# EAGLE design traffic light (EAGLE 9.6.2)
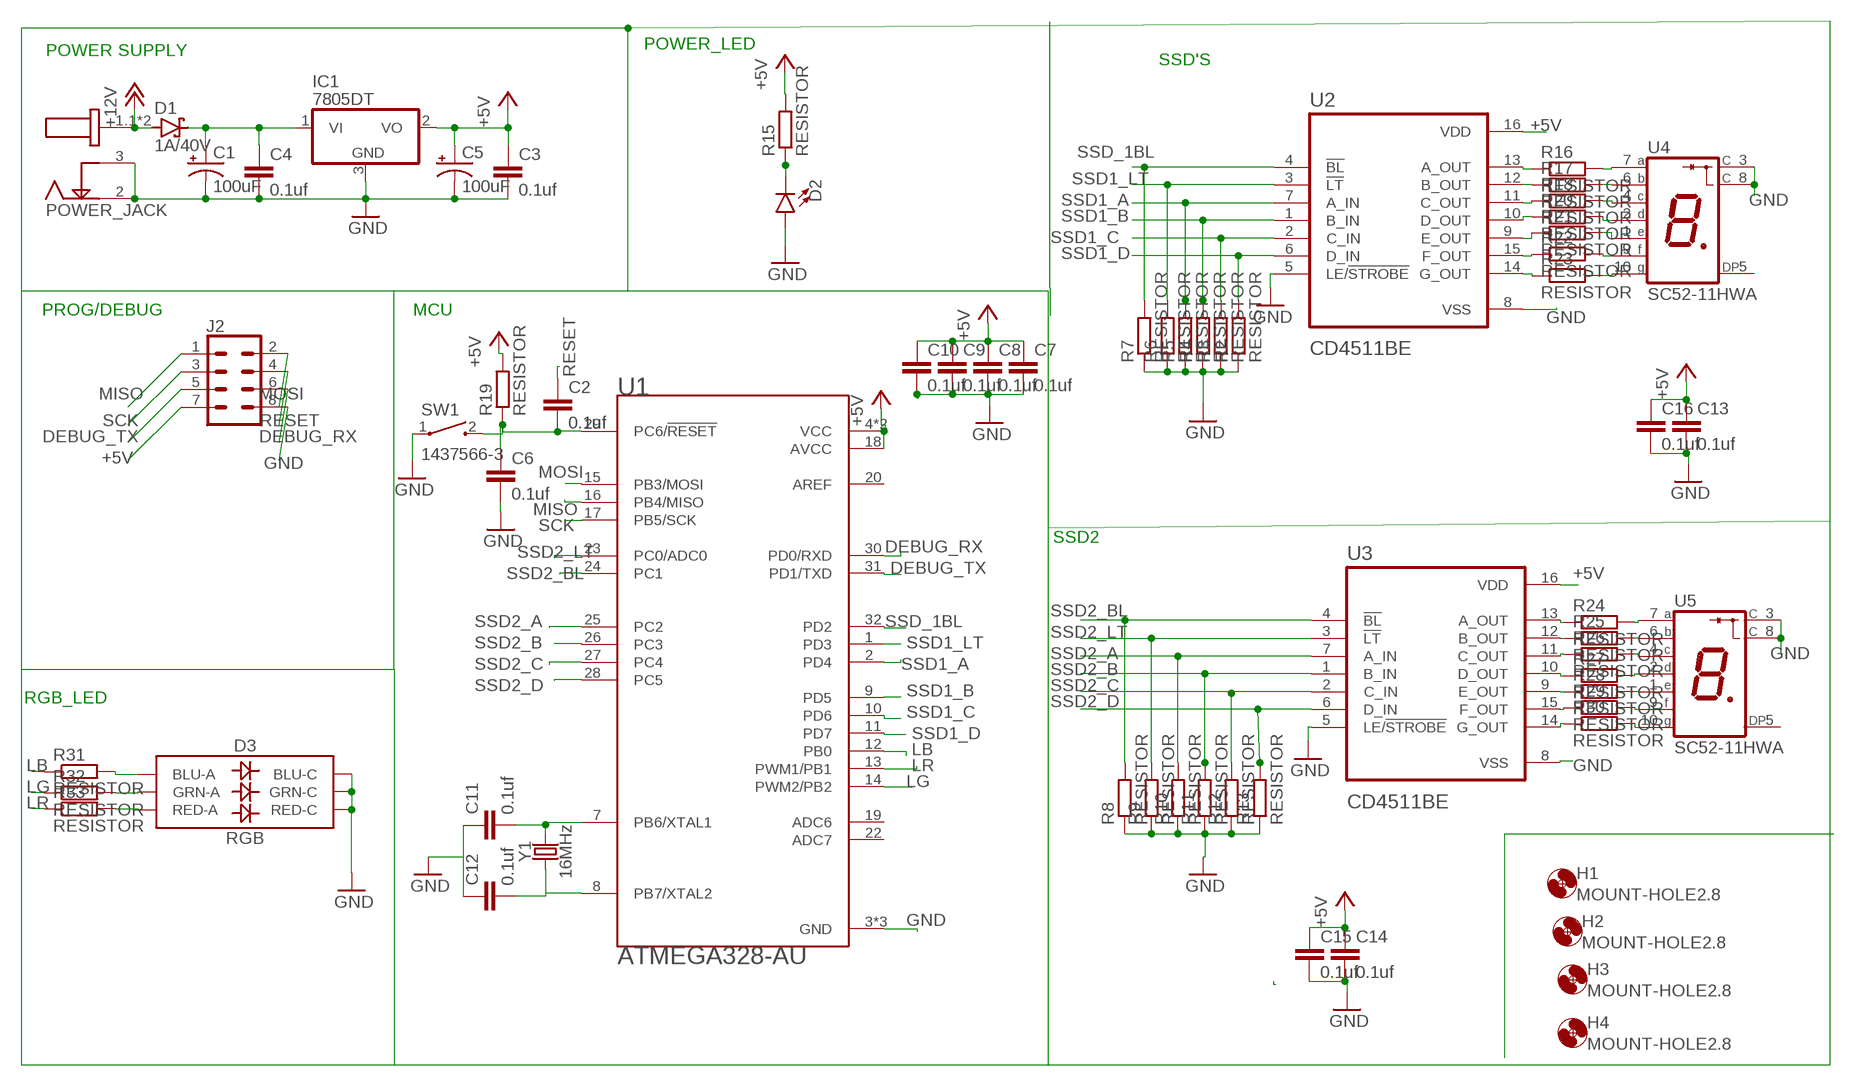
[diagram p0: schematic, sheet 1]

## Parts
C1  100uF  100UF-POLAR-25V-20%-SMD(ELEC)  [PANASONIC_D]
C2  0.1uf  C2.5/2  [C2.5-2]
C3  0.1uf  C2,5-3  [C2.5-3]
C4  0.1uf  C2.5/2  [C2.5-2]
C5  100uF  100UF-POLAR-25V-20%-SMD(ELEC)  [PANASONIC_D]
C6  0.1uf  C2.5/2  [C2.5-2]
C7  0.1uf  C2,5-3  [C2.5-3]
C8  0.1uf  C2,5-3  [C2.5-3]
C9  0.1uf  C2,5-3  [C2.5-3]
C10  0.1uf  C2,5-3  [C2.5-3]
C11  0.1uf  C2.5/2  [C2.5-2]
C12  0.1uf  C2.5/2  [C2.5-2]
C13  0.1uf  C2,5-3  [C2.5-3]
C14  0.1uf  C2,5-3  [C2.5-3]
C15  0.1uf  C2,5-3  [C2.5-3]
C16  0.1uf  C2,5-3  [C2.5-3]
D1  1A/40V  SCHOTTKY-DIODEC4111-15  [C4111-15]
D2  LED0603  [LED-0603]
D3  RGB  LED-RGBPLCC-6  [PLCC-6-LED]
H1  MOUNT-HOLE2.8  [2,8]
H2  MOUNT-HOLE2.8  [2,8]
H3  MOUNT-HOLE2.8  [2,8]
H4  MOUNT-HOLE2.8  [2,8]
IC1  7805DT  [TO252]
J2  CONN_04X2  [2X4]
POWER_JACK  DCJ200-05-A-XX-X_REVA  [GCT_DCJ200-05-A-XX-X_REVA]
R2  RESISTOR  [R0603]
R3  RESISTOR  [R0603]
R4  RESISTOR  [R0603]
R5  RESISTOR  [R0603]
R6  RESISTOR  [R0603]
R7  RESISTOR  [R0603]
R8  RESISTOR  [R0603]
R9  RESISTOR  [R0603]
R10  RESISTOR  [R0603]
R11  RESISTOR  [R0603]
R12  RESISTOR  [R0603]
R13  RESISTOR  [R0603]
R15  RESISTOR  [R0603]
R16  RESISTOR  [R0603]
R17  RESISTOR  [R0603]
R18  RESISTOR  [R0603]
R19  RESISTOR  [R0603]
R20  RESISTOR  [R0603]
R21  RESISTOR  [R0603]
R22  RESISTOR  [R0603]
R23  RESISTOR  [R0603]
R24  RESISTOR  [R0603]
R25  RESISTOR  [R0603]
R26  RESISTOR  [R0603]
R27  RESISTOR  [R0603]
R28  RESISTOR  [R0603]
R29  RESISTOR  [R0603]
R30  RESISTOR  [R0603]
R31  RESISTOR  [R0603]
R32  RESISTOR  [R0603]
R33  RESISTOR  [R0603]
SW1  1437566-3  [SW_1437566-3]
U1  ATMEGA328-AU  [QFP80P900X900X120-32N]
U2  CD4511BE  [DIP794W45P254L1969H508Q16]
U3  CD4511BE  [DIP794W45P254L1969H508Q16]
U4  SC52-11HWA  [LED_SC52-11HWA]
U5  SC52-11HWA  [LED_SC52-11HWA]
Y1  16MHz  CRYSTAL-16MHZPTH-HC49US  [HC49US]

## Nets
+5V: C3.1 C5.+ C7.1 C8.1 C9.1 C10.1 C13.1 C14.1 C15.1 C16.1 IC1.2(VO) J2.7 R15.2 R19.2 U1.4(VCC) U1.6(VCC) U1.18(AVCC) U2.16(VDD) U3.16(VDD)
+12V: D1.A POWER_JACK.1.1 POWER_JACK.1.2
DEBUG_RX: J2.6 U1.30(PD0/RXD)
DEBUG_TX: J2.5 U1.31(PD1/TXD)
GND: C1.- C3.2 C4.2 C5.- C6.2 C7.2 C8.2 C9.2 C10.2 C13.2 C14.2 C15.2 C16.2 D2.A D3.CB(BLU-C) D3.CG(GRN-C) D3.CR(RED-C) IC1.3(GND) J2.8 POWER_JACK.2 POWER_JACK.3 R2.1 R3.1 R4.1 R5.1 R6.1 R7.1 R8.1 R9.1 R10.1 R11.1 R12.1 R13.1 SW1.1 U1.3(GND) U1.5(GND) U1.21(GND) U2.5(LE/!STROBE) U2.8(VSS) U3.5(LE/!STROBE) U3.8(VSS) U4.3(C) U4.8(C) U5.3(C) U5.8(C)
LB: R31.1 U1.12(PB0)
LG: R32.1 U1.14(PWM2/PB2)
LR: R33.1 U1.13(PWM1/PB1)
MISO: J2.1 U1.16(PB4/MISO)
MOSI: J2.2 U1.15(PB3/MOSI)
N$4: C1.+ C4.1 D1.C IC1.1(VI)
N$5: D3.AB(BLU-A) R31.2
N$6: D3.AG(GRN-A) R32.2
N$8: D2.C R15.1
N$9: R16.1 U2.13(A_OUT)
N$10: R16.2 U4.7(A)
N$11: R17.2 U4.6(B)
N$12: R17.1 U2.12(B_OUT)
N$13: R18.1 U2.11(C_OUT)
N$14: R20.1 U2.10(D_OUT)
N$15: R21.1 U2.9(E_OUT)
N$16: R22.1 U2.15(F_OUT)
N$17: R24.1 U3.13(A_OUT)
N$18: R24.2 U5.7(A)
N$19: R25.1 U3.12(B_OUT)
N$20: R26.1 U3.11(C_OUT)
N$21: R27.1 U3.10(D_OUT)
N$22: R28.1 U3.9(E_OUT)
N$23: R29.1 U3.15(F_OUT)
N$47: C2.2 C6.1 R19.1 SW1.2 U1.29(PC6/!RESET)
N$48: C11.2 U1.7(PB6/XTAL1) Y1.2
N$49: C12.2 U1.8(PB7/XTAL2) Y1.1
N$50: C11.1 C12.1
N$51: R23.1 U2.14(G_OUT)
N$52: R18.2 U4.4(C)
N$53: R20.2 U4.2(D)
N$54: R21.2 U4.1(E)
N$55: R22.2 U4.9(F)
N$56: R23.2 U4.10(G)
N$57: R30.1 U3.14(G_OUT)
N$58: R30.2 U5.10(G)
N$59: R29.2 U5.9(F)
N$60: R25.2 U5.6(B)
N$61: R26.2 U5.4(C)
N$62: R27.2 U5.2(D)
N$63: R28.2 U5.1(E)
N$65: D3.AR(RED-A) R33.2
RESET: C2.1 J2.4
SCK: J2.3 U1.17(PB5/SCK)
SSD1_A: R5.2 U1.2(PD4) U2.7(A_IN)
SSD1_B: R4.2 U1.9(PD5) U2.1(B_IN)
SSD1_C: R3.2 U1.10(PD6) U2.2(C_IN)
SSD1_D: R2.2 U1.11(PD7) U2.6(D_IN)
SSD1_LT: R6.2 U1.1(PD3) U2.3(!LT)
SSD2_A: R10.2 U1.25(PC2) U3.7(A_IN)
SSD2_B: R11.2 U1.26(PC3) U3.1(B_IN)
SSD2_BL: R8.2 U1.24(PC1) U3.4(!BL)
SSD2_C: R12.2 U1.27(PC4) U3.2(C_IN)
SSD2_D: R13.2 U1.28(PC5) U3.6(D_IN)
SSD2_LT: R9.2 U1.23(PC0/ADC0) U3.3(!LT)
SSD_1BL: R7.2 U1.32(PD2) U2.4(!BL)
Unconnected: U1.19(ADC6) U1.20(AREF) U1.22(ADC7) U4.5(DP) U5.5(DP)

## Notes on the sheet
- POWER_LED
- POWER SUPPLY
- SSD'S
- PROG/DEBUG | MCU
- SSD2
- RGB_LED

## Library data of the parts
C1 C5 = SparkFun-Capacitors:100UF-POLAR: 100µF polarized capacitors A capacitor is a passive two-terminal electrical component used to store electrical energy temporarily in an electric field.; PN: EDH107M025A9HAA; PROD_ID: CAP-17222
C2-C4 C6-C16 = capacitor-wima:C: CAPACITOR naming: grid - package width
D1 = diode:SCHOTTKY-DIODE: Schottky Diode
D2 = SparkFun-LED:LED: LED (Generic) Standard schematic elements and footprints for 5mm, 3mm, 1206, and 0603 sized LEDs. Generic LEDs with no color specified.
D3 = SparkFun-LED:LED-RGB: LED-RGB 6 pin RGB LED (no common connector) Packages: PLCC-6 LED-TRICOLOR-5050 - No built-in IC SparkFun Products: Digital Sandbox <https://www.sparkfun.com/products/12651> LED- SMD RGB <https://www.sparkfun.com/products/10866>; PROD_ID: DIO-12113
H1-H4 = holes:MOUNT-HOLE: MOUNTING HOLE with drill center marker
IC1 = PC_IC_L7805_TO252:78*: Positive VOLTAGE REGULATOR Source: http://cache.national.com/ds/LM/LM78L05.pdf http://www.fairchildsemi.com/ds/LM/LM7805.pdf
J2 = SparkFun-Connectors:CONN_04X2: Multi connection point. Often used as Generic Header-pin footprint for 0.1 inch spaced/style header connections On any of the 0.1 inch spaced packages, you can populate with these: Break Away Headers - Straight <https://www.sparkfun.com/products/116> (PRT-00116) Break Away Male Headers - Right Angle <https://www.sparkfun.com/products/553> (PRT-00553) Female Headers <https://www.sparkfun.com/products/115> (PRT-00115) Break Away Headers - Machine Pin <https://www.sparkfun.com/products/117> (PRT-00117) Break Away Female Headers - Swiss Machine Pin <https://www.sparkfun.com/products/743> (PRT-00743)
POWER_JACK = PC_CON_DC_Power_Jack:DCJ200-05-A-XX-X_REVA: DC Power Jack, SMT, Horizontal, with Locating Pegs, D2.0mm Check prices <https://pricing.snapeda.com/parts/DCJ200-05-A-K1-A/Global%20Connector%20Technology/view-part?ref=eda>; AVAILABILITY: Warning; DESCRIPTION: Power Barrel Connector Jack 2.05mm ID (0.081), 5.50mm OD (0.217) Surface Mount, Right Angle; MF: Global Connector Technology; MP: DCJ200-05-A-K1-A; PACKAGE: None; PRICE: None; PURCHASE-URL: https://pricing.snapeda.com/search/part/DCJ200-05-A-K1-A/?ref=eda
R2-R13 R15-R33 = PC_Resistor_0603:RESISTOR; MF: Yageo; RESISTOR: 0603
SW1 = PC_Switch_1437566-3:1437566-3: Switch Tactile OFF (ON) SPST Rectangular Button Gull Wing 0.05A 12VDC SMD Loose Piece Check prices <https://pricing.snapeda.com/parts/1437566-3/TE%20Connectivity/view-part?ref=eda>; AVAILABILITY: Good; COMMENT: 1437566-3; CONFIGURATION_POLE-THROW: Single Pole - Single Throw; CONTACT_CURRENT_RATING: 50 mA; DESCRIPTION: Tactile Switch SPST-NO Top Actuated Surface Mount; MF: TE Connectivity; MP: 1437566-3; PACKAGE: None; PRICE: None
U1 = PC_IC_ATMEGA328P-AU:ATMEGA328-AU: ATmega Series 20 MHz 32 KB Flash 2 KB SRAM 8-Bit Microcontroller - TQFP-32 Check prices <https://pricing.snapeda.com/parts/ATMEGA328-AU/Microchip/view-part?ref=eda>; AVAILABILITY: In Stock; DESCRIPTION: AVR AVR® ATmega Microcontroller IC 8-Bit 20MHz 32KB (16K x 16) FLASH 32-TQFP (7x7); MF: Microchip; MP: ATMEGA328-AU; PACKAGE: TQFP-32 Microchip; PRICE: None; PURCHASE-URL: https://pricing.snapeda.com/search/part/ATMEGA328-AU/?ref=eda
U2 U3 = PC_IC_CD4511BE:CD4511BE: None Check availability <https://pricing.snapeda.com/parts/CD4511BE/Texas%20Instruments/view-part?ref=eda>; AVAILABILITY: In Stock; DESCRIPTION: CMOS BCD-to-7-Segment LED Latch Decoder Drivers 16-PDIP -55 to 125; MF: Texas Instruments; MP: CD4511BE; PACKAGE: PDIP-16 Texas Instruments; PRICE: None; PURCHASE-URL: https://pricing.snapeda.com/search/part/CD4511BE/?ref=eda
U4 U5 = PC_LED-7-SegmentDisplay:SC52-11HWA: Display: LED; single 7-segment; 13.2mm; red; 0.9-2.2mcd Check availability <https://pricing.snapeda.com/parts/SC52-11HWA/Kingbright/view-part?ref=eda>; AVAILABILITY: Not in stock; DESCRIPTION: Display: LED; single 7-segment; 13.2mm; red; 0.9-2.2mcd; MF: Kingbright; MP: SC52-11HWA; PACKAGE: None; PRICE: None
Y1 = SparkFun-Clocks:CRYSTAL-16MHZ: 16MHz Crystal Digikey Example <http://www.digikey.com/product-search/en?keywords=535-9122-1-ND> Frequency: 16MHz Frequency Stability: ±50ppm Frequency Tolerance: ±20ppm Load Capacitance: 18pF SparkFun Products: Pro Micro -5V/16MHz <https://www.sparkfun.com/products/12640> SparkFun Serial Enabled LCD Kit <https://www.sparkfun.com/products/10097>; PROD_ID: XTAL-08181; SF_ID: COM-00536

## Board
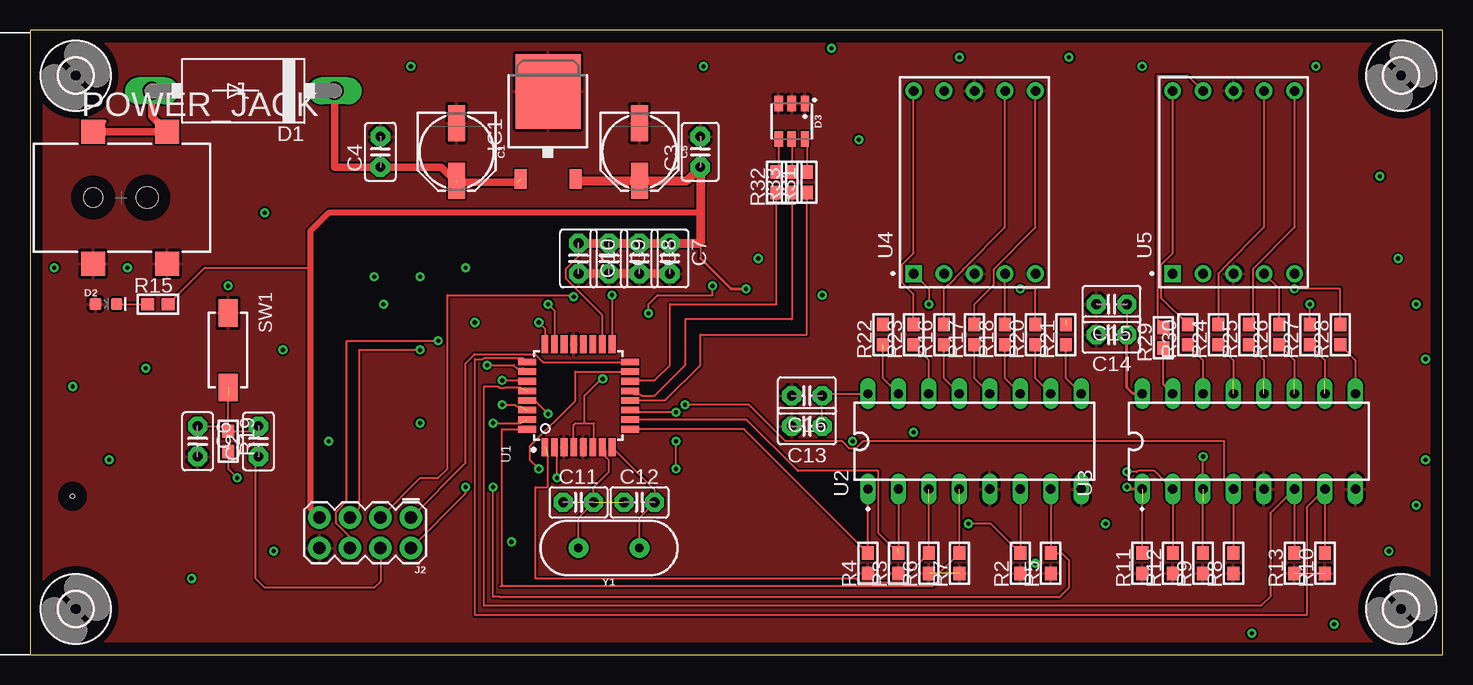
[diagram p1: board, top side]
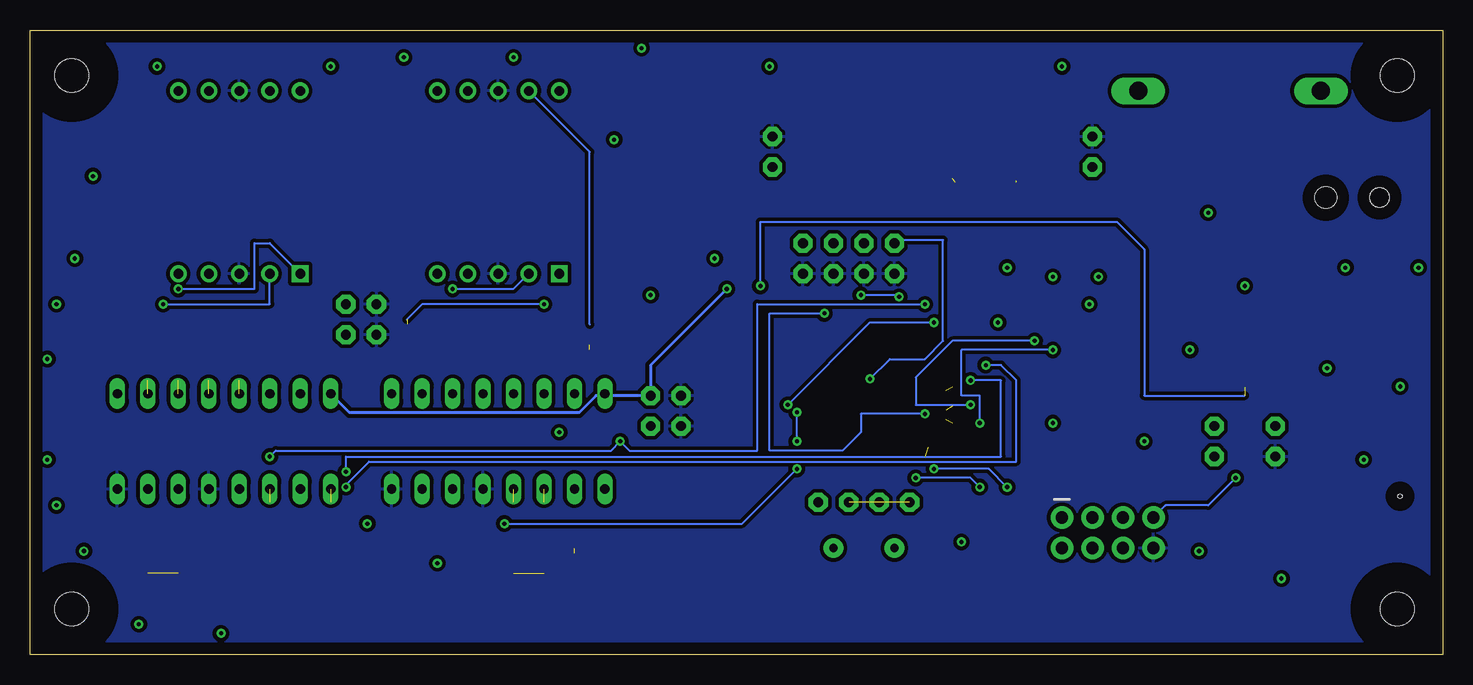
[diagram p2: board, bottom side, seen from below]

Size 117.78 x 52.06 mm. Coordinates in mm from the lower left corner, seen from the top.
Outline: 0,0 117.78,0 117.78,52.06 0,52.06 0,0
Copper layers (1*16): Top 0.035mm / dielectric 1.5mm / Bottom 0.035mm
Design rules "default": minimum track width 6mil, minimum drill 0.35mm, track to track 6mil, track to pad 6mil, pad to pad 6mil, via to via 6mil, smd to smd 6mil, copper to edge 40mil, drill to drill 6mil, minimum pad ring 10mil, minimum via ring 8mil, stop-mask expansion 4mil, vias tented up to drill 0mil, thermal gap 10mil
Holes 0.35 mm at 3.56,13.21 3.56,13.21

### Footprints (pad centres in the part's own frame; a part is rotated, then mirrored left to right if it is on the bottom)
PANASONIC_D = smd 3 x 1.4: + 2.4,0; - -2.4,0
C2.5-2 = drill 0.813 pad 1.6 octagon: 1 -1.27,0; 2 1.27,0
C2.5-3 = drill 0.813 pad 1.6 octagon: 1 -1.27,0; 2 1.27,0
C4111-15 = drill 1.499 long: A 7.62,0; C -7.62,0
LED-0603 = smd 1 x 1: A -0.877,0; C 0.877,0
PLCC-6-LED = smd 1.3 x 0.7: AB 1.475,1.1; AG 1.475,-1.1; AR 1.475,0; CB -1.475,1.1; CG -1.475,-1.1; CR -1.475,0
2,8 = hole 2.8: 0,0
TO252 = smd 1 x 1.6: 1 -2.28,-4.8; 2 2.28,-4.8 | smd 5.4 x 6.2: 3 0,2.5
2X4 = drill 1.016 pad 1.88: 1 -3.81,-1.27; 2 -3.81,1.27; 3 -1.27,-1.27; 4 -1.27,1.27; 5 1.27,-1.27; 6 1.27,1.27; 7 3.81,-1.27; 8 3.81,1.27
GCT_DCJ200-05-A-XX-X_REVA = smd 2 x 2: 1.1 -5.5,3.8; 1.2 -5.5,-2.35; 2 5.5,-2.35; 3 5.5,3.8 | hole 1.8: 0,2.15 | hole 1.6: 0,-2.35
R0603 = smd 1.1 x 1: 1 -0.85,0; 2 0.85,0
SW_1437566-3 = smd 2.3 x 1.6: 1 -3.08,0; 2 3.12,0
QFP80P900X900X120-32N = smd 1.5 x 0.55: 1 -4.3,2.8; 2 -4.3,2; 3 -4.3,1.2; 4 -4.3,0.4; 5 -4.3,-0.4; 6 -4.3,-1.2; 7 -4.3,-2; 8 -4.3,-2.8; 17 4.3,-2.8; 18 4.3,-2; 19 4.3,-1.2; 20 4.3,-0.4; 21 4.3,0.4; 22 4.3,1.2; 23 4.3,2; 24 4.3,2.8 | smd 0.55 x 1.5: 9 -2.8,-4.3; 10 -2,-4.3; 11 -1.2,-4.3; 12 -0.4,-4.3; 13 0.4,-4.3; 14 1.2,-4.3; 15 2,-4.3; 16 2.8,-4.3; 25 2.8,4.3; 26 2,4.3; 27 1.2,4.3; 28 0.4,4.3; 29 -0.4,4.3; 30 -1.2,4.3; 31 -2,4.3; 32 -2.8,4.3
DIP794W45P254L1969H508Q16 = drill 0.78 pad 1.13 long: 1 -3.97,8.89; 2 -3.97,6.35; 3 -3.97,3.81; 4 -3.97,1.27; 5 -3.97,-1.27; 6 -3.97,-3.81; 7 -3.97,-6.35; 8 -3.97,-8.89; 9 3.97,-8.89; 10 3.97,-6.35; 11 3.97,-3.81; 12 3.97,-1.27; 13 3.97,1.27; 14 3.97,3.81; 15 3.97,6.35; 16 3.97,8.89
LED_SC52-11HWA = drill 0.8 pad 1.4 square: 1 -7.62,5.08 | drill 0.8 pad 1.4: 2 -7.62,2.54; 3 -7.62,0; 4 -7.62,-2.54; 5 -7.62,-5.08; 6 7.62,-5.08; 7 7.62,-2.54; 8 7.62,0; 9 7.62,2.54; 10 7.62,5.08
HC49US = drill 0.7 pad 1.651: 1 -2.54,0; 2 2.54,0

### Placement (x,y rotation side)
C1  35.56,41.91 270 top
C2  19.05,17.78 90 top
C3  55.88,41.91 90 top
C4  29.21,41.91 90 top
C5  50.8,41.91 270 top
C6  13.97,17.78 270 top
C7  53.34,33.02 270 top
C8  50.8,33.02 270 top
C9  48.26,33.02 270 top
C10  45.72,33.02 270 top
C11  45.72,12.7 0 top
C12  50.8,12.7 0 top
C13  64.77,19.05 180 top
C14  90.17,26.67 180 top
C15  90.17,29.21 180 top
C16  64.77,21.59 180 top
D1  17.78,46.99 180 top
D2  6.35,29.21 0 top
D3  63.5,44.45 270 top
H1  114.3,3.81 0 top
H2  3.81,3.81 0 top
H3  114.3,48.26 0 top
H4  3.81,48.26 0 top
IC1  43.18,44.45 0 top
J2  27.94,10.16 180 top
POWER_JACK  7.62,38.1 270 top
R2  82.55,7.62 90 top
R3  72.39,7.62 90 top
R4  69.85,7.62 90 top
R5  85.09,7.62 90 top
R6  74.93,7.62 90 top
R7  77.47,7.62 90 top
R8  100.33,7.62 90 top
R9  97.79,7.62 90 top
R10  107.95,7.62 90 top
R11  92.71,7.62 90 top
R12  95.25,7.62 90 top
R13  105.41,7.62 90 top
R15  10.67,29.21 0 top
R16  76.2,26.67 90 top
R17  78.74,26.67 90 top
R18  81.28,26.67 90 top
R19  16.51,17.78 270 top
R20  83.82,26.67 90 top
R21  86.36,26.67 90 top
R22  71.12,26.67 90 top
R23  73.66,26.67 90 top
R24  99.06,26.67 90 top
R25  101.6,26.67 90 top
R26  104.14,26.67 90 top
R27  106.68,26.67 90 top
R28  109.22,26.67 90 top
R29  94.49,26.42 90 top
R30  96.52,26.67 90 top
R31  64.77,39.37 90 top
R32  62.23,39.37 90 top
R33  63.5,39.37 90 top
SW1  16.51,25.4 270 top
U1  45.72,21.59 90 top
U2  78.74,17.78 90 top
U3  101.6,17.78 90 top
U4  78.74,39.37 90 top
U5  100.33,39.37 90 top
Y1  48.26,8.89 180 top

### Tracks (layer width: path | path; a pad name or v marks a point on that pad's centre or on a via)
+5V  (via drill 0.35)
  Top 0.152: U1.18 47.72,28.29 44.69,31.32 44.69,32.18 45.72,33.2 C10.1 | C13.1 C16.1 66.2,21.75 U2.16 | C15.1 C14.1 | 55.88,34.29 55.88,33.02 | R19.2 16.51,15.49 v17.27,14.73 | R15.2 14.57,32.26 23.37,32.26 | U1.4 45.32,19.16 45.47,19.3 46.23,19.3 | 46.23,19.3 46.99,19.3 46.99,17.36 U1.6 | 46.23,19.3 46.23,21.59 47.75,23.11 v47.75,22.98
  Top 0.254: 55.88,33.02 58.42,30.48 v59.69,30.48 | U3.16 91.95,21.75 91.44,22.26 C14.1
  Top 0.508: 55.88,36.83 24.89,36.83 23.37,35.31 23.37,32.26 23.37,12.19 J2.7
  Top 0.737: IC1.2 45.6,39.51 C5.+ 54.75,39.51 C3.1 55.88,36.83 55.88,34.29 C7.1 C8.1 C9.1 C10.1
  Bottom 0.152: v17.27,14.73 19.56,12.45 23.11,12.45 J2.7 | v47.75,22.98 46.1,24.64 43.18,24.64 41.66,26.16 41.66,34.54 45.47,34.54 C10.1
  Bottom 0.254: v59.69,30.48 66.04,24.13 C16.1 70.6,21.59 72.01,20.18 91.14,20.18 U3.16
+12V
  Top 0.152: POWER_JACK.1.2 5.5,43.6 6.35,44.45
  Top 0.635: POWER_JACK.1.2 POWER_JACK.1.1 10.16,44.86 D1.A
DEBUG_RX  (via drill 0.35)  (1 unrouted)
  Top 0.152: J2.6 26.67,9.78 25.5,10.95 25.5,11.91 26.42,12.83 26.42,26.16 v34.04,26.16 | 40.89,20.69 40.57,20.69 40.43,20.83 v39.37,20.83
  Bottom 0.152: v34.04,26.16 40.89,26.16 43.94,23.11 43.94,20.83 v39.37,20.83
DEBUG_TX  (via drill 0.35)  (1 unrouted)
  Top 0.152: J2.5 27.43,12.19 27.43,25.4 v32.51,25.4 | v38.61,19.3 40.89,19.3
  Bottom 0.152: v32.51,25.4 40.13,25.4 40.13,21.59 38.61,21.59 v38.61,19.3
GND  (2 unrouted)
  Top 0.737: C7.2 C8.2 C9.2 C10.2
  pour Top: -2.54,55.12 121.67,55.12 121.67,-2.79 120.9,-3.56 -2.54,-3.56 -3.3,-4.32 -3.3,55.12
  pour Bottom (isolate 0.305): -1.02,54.36 120.9,54.36 121.67,53.59 121.67,-2.79 -1.78,-2.79 -3.3,-1.27 -3.3,54.36 -2.54,55.12 -1.78,55.12
LB
  Top 0.152: U1.12 52.94,21.19 55.88,24.13 55.88,26.67 64.77,26.67 R31.1
LG
  Top 0.152: U1.14 50.09,22.86 52.07,22.86 53.34,24.13 53.34,29.21 62.23,29.21 R32.1
LR
  Top 0.152: R33.1 63.5,27.94 54.61,27.94 54.61,24.13 52.07,21.59 50.97,21.59 50.86,21.69 50.32,21.69 U1.13
MISO
  Top 0.152: J2.1 36.32,16 36.32,24.31 37.06,25.04 42.12,25.04 42.77,24.39 U1.16
MOSI  (via drill 0.35)
  Top 0.152: J2.2 36.32,13.46 v36.32,13.97 | v42.42,15.48 41.66,16.24 41.66,17.37 45.47,21.18 45.47,23.59 U1.15
  Bottom 0.152: v36.32,13.97 37.85,15.49 42.42,15.49 v42.42,15.48
N$4  (2 unrouted)
  Top 0.635: D1.C 25.4,40.64 C4.1 34.29,40.64 35.56,39.37 | C1.+ 35.7,39.37 40.64,39.37
N$5
  Top 0.152: D3.AB 64.77,42.81 R31.2
N$6
  Top 0.152: D3.AG 62.4,40.39 R32.2
N$7  (via drill 0.35)
  other vias: 83.82,7.62
N$8
  Top 0.152: D2.C R15.1
N$9
  Top 0.152: U2.13 76.2,23.02 R16.1
N$10
  Top 0.152: R16.2 76.2,30.48 76.54,30.82 76.58,30.82 77.13,31.36 77.13,31.41 77.81,32.09 77.81,32.14 81.28,35.6 U4.7
N$11
  Top 0.152: R17.2 78.74,29.21 80.35,30.82 80.35,32.14 83.82,35.6 U4.6
N$12
  Top 0.152: U2.12 78.74,23.02 R17.1
N$13
  Top 0.152: U2.11 81.28,23.02 R18.1
N$14
  Top 0.152: U2.10 83.82,23.02 R20.1
N$15
  Top 0.152: U2.9 86.36,23.02 R21.1
N$16  (1 unrouted)
  Top 0.152: U2.15 71.12,23.02 71.12,25.4
N$17  (1 unrouted)
  Top 0.152: R24.1 100.33,24.55 100.33,22.86
N$18
  Top 0.152: U5.7 102.87,35.6 99.4,32.14 99.4,32.09 99.06,31.75 R24.2
N$19  (1 unrouted)
  Top 0.152: R25.1 102.87,24.55 102.87,22.86
N$20  (1 unrouted)
  Top 0.152: R26.1 105.41,24.55 105.41,22.86
N$21  (1 unrouted)
  Top 0.152: R27.1 107.95,24.55 107.95,22.86
N$22
  Top 0.152: R28.1 110.49,24.55 U3.9
N$23
  Top 0.152: U3.15 94.49,22.51 R29.1
N$24  (via drill 0.35)
  other vias: 9.65,23.88
N$25  (via drill 0.35)
  other vias: 16.51,30.73
N$26  (via drill 0.35)
  other vias: 3.56,22.35
N$27  (via drill 0.35)
  other vias: 2.03,32.26
N$28  (via drill 0.35)
  other vias: 8.13,32.26
N$29  (via drill 0.35)
  other vias: 19.56,36.83
N$30  (via drill 0.35)
  other vias: 31.75,49.02
N$31  (via drill 0.35)
  other vias: 56.13,49.02
N$32  (via drill 0.35)
  other vias: 66.8,50.55
N$33  (via drill 0.35)
  other vias: 77.47,49.78
N$34  (via drill 0.35)
  other vias: 86.61,49.78
N$35  (via drill 0.35)
  other vias: 92.71,49.02
N$36  (via drill 0.35)
  other vias: 107.19,49.02
N$37  (via drill 0.35)
  other vias: 112.52,39.88
N$38  (via drill 0.35)
  other vias: 114.05,33.02
N$39  (via drill 0.35)
  other vias: 115.57,29.21
N$40  (via drill 0.35)
  other vias: 116.33,24.64
N$42  (via drill 0.35)
  other vias: 116.33,16.26
N$43  (via drill 0.35)
  other vias: 115.57,12.45
N$44  (via drill 0.35)
  other vias: 113.28,8.64
N$45  (via drill 0.35)
  other vias: 108.71,2.54
N$46  (via drill 0.35)
  other vias: 101.85,1.78
N$47  (via drill 0.35)  (1 unrouted)
  Top 0.152: R19.1 18.63,18.63 C2.2 | R19.1 16.51,21.59 SW1.2 | C6.1 16.09,19.05 R19.1 | U1.29 42.06,21.19 v43.18,20.07 | v51.56,28.45 51.56,29.21 52.32,29.97 56.9,29.97 v56.9,30.73
  Bottom 0.152: v43.18,20.07 48.51,20.07 48.51,18.54 50.04,17.02 56.13,17.02 56.13,28.45 v51.56,28.45 | v56.9,30.73 56.9,36.07 27.18,36.07 24.89,33.78 24.89,21.59 16.51,21.59
N$48
  Top 0.152: U1.7 48.02,16.99 48.02,16.44 48.26,16.2 48.26,15.24 46.99,13.97 C11.2 45.72,11.43 Y1.2
N$49
  Top 0.152: U1.8 52.07,13.74 C12.2 50.8,11.43 Y1.1
N$50  (1 unrouted)
N$51
  Top 0.152: U2.14 74.93,24.55 R23.1
N$52
  Top 0.152: R18.2 U4.4
N$53  (via drill 0.35)
  Top 0.152: R20.2 83.82,30.48 v82.55,30.48
  Bottom 0.152: v82.55,30.48 77.47,30.48 U4.2
N$54  (via drill 0.35)  (1 unrouted)
  Top 0.152: U4.1 74.93,30.48 v74.93,29.21
  Bottom 0.152: v74.93,29.21 85.09,29.21 86.36,27.94
N$55  (1 unrouted)
  Bottom 0.152: R22.2 71.12,41.91 U4.9
N$56
  Top 0.152: R23.2 73.66,30.03 72.73,30.96 72.73,32.55 73.66,33.47 U4.10
N$57
  Top 0.152: R30.1 97.79,24.55 U3.14
N$58
  Top 0.152: U5.10 95.25,33.47 94.32,32.55 94.32,29.72 R30.2
N$59
  Top 0.152: R29.2 94.37,27.39 93.98,28.11 93.98,48.26 96.52,48.26 U5.9
N$60
  Top 0.152: R25.2 101.94,27.86 101.94,32.14 105.41,35.6 U5.6
N$61
  Top 0.152: R26.2 104.14,30.48 U5.4
N$62  (via drill 0.35)
  Top 0.152: R27.2 v106.68,29.21
  Bottom 0.152: v106.68,29.21 97.79,29.21 U5.2
N$63  (via drill 0.35)
  Top 0.152: R28.2 109.22,30.48 v105.41,30.48
  Bottom 0.152: v105.41,30.48 99.06,30.48 99.06,34.29 97.79,34.29 U5.1
N$65
  Top 0.152: D3.AR R33.2
N$66  (via drill 0.35)
  other vias: 89.66,10.92
N$67  (via drill 0.35)
  other vias: 73.66,18.54
N$68  (via drill 0.35)
  other vias: 66.04,29.97
N$69  (via drill 0.35)
  other vias: 60.71,33.02
N$70  (via drill 0.35)
  other vias: 36.32,32.26
N$71  (via drill 0.35)
  other vias: 37.08,27.69
N$72  (via drill 0.35)
  other vias: 32.51,19.3
N$73  (via drill 0.35)
  other vias: 32.51,31.5
N$74  (via drill 0.35)
  other vias: 24.89,17.78
N$75  (via drill 0.35)
  other vias: 20.32,8.64
N$76  (via drill 0.35)
  other vias: 13.46,6.35
N$77  (via drill 0.35)
  other vias: 6.6,16.26
N$78  (via drill 0.35)
  other vias: 21.08,25.4
N$79  (via drill 0.35)
  other vias: 69.09,42.93
N$80  (via drill 0.35)
  other vias: 28.7,31.5
N$81  (via drill 0.35)
  other vias: 29.46,29.21
N$82  (via drill 0.35)
  other vias: 40.13,9.4
RESET
  Top 0.152: J2.4 29.21,6.1 28.7,5.59 19.56,5.59 18.8,6.35 18.8,16.26 C2.1
SCK  (via drill 0.35)
  Top 0.152: J2.3 32.51,14.73 34.04,14.73 34.8,15.49 34.8,29.97 45.47,29.97 v45.33,29.83 | v48.51,29.97 v48.52,29.97 U1.17
  Bottom 0.152: v45.33,29.83 45.47,29.97 v48.51,29.97
SSD1_A  (via drill 0.35)
  Top 0.152: U2.7 R5.2 86.02,8.47 86.61,7.87 86.61,5.59 85.8,4.78 39.24,4.78 39.19,4.83 38.61,4.83 v38.61,13.97 | U1.2 43.94,17.07 v43.94,14.73
  Bottom 0.152: v38.61,13.97 39.37,14.73 v43.94,14.73
SSD1_B
  Top 0.152: U2.1 R4.2 59.53,18.79 U1.9
SSD1_C  (1 unrouted)
  Top 0.152: U2.2 72.39,8.89 | U1.10 59.75,19.59 64.01,15.33 70.72,15.33 70.72,10.14 R3.2
SSD1_D  (via drill 0.35)
  Top 0.152: U2.6 R2.2 80.1,10.92 v78.23,10.92 | v53.85,15.48 v53.85,17.78 | v53.85,20.2 50.21,20.2 U1.11
  Bottom 0.152: v78.23,10.92 58.42,10.92 53.85,15.49 v53.85,15.48 | v53.85,17.78 v53.85,20.2
SSD1_LT  (2 unrouted)
  Top 0.152: 74.93,12.7 R6.2 73.12,6.66 73.12,6.12 72.98,5.99 69.25,5.99 68.9,6.35 42.16,6.35 42.16,13.97 43.18,13.97 43.18,16.51
SSD2_A
  Top 0.152: R10.2 U3.7 106.43,12.29 106.43,3.3 37.08,3.3 37.08,24.64 37.75,24.64 37.85,24.74 41.07,24.74 U1.25
SSD2_B  (via drill 0.35)  (1 unrouted)
  Top 0.152: R11.2 92.71,12.7 | U1.26 41.12,23.89 40.57,23.89 40.33,24.13 v38.1,24.13
  Top 0.254: U3.1 91.6,13.81 v91.44,13.97
  Bottom 0.152: v91.44,13.97 91.44,14.16 89.52,16.09 35.56,16.09 35.56,22.86 36.83,24.13 v38.1,24.13
SSD2_BL  (via drill 0.35)
  Top 0.152: R8.2 U3.4 99.57,14.57 99.57,17.78 69.44,17.78 68.83,17.17 68.33,17.17 67.72,17.78 62.99,17.78 59.94,20.83 v54.61,20.83 | v42.42,27.69 42.92,27.18 U1.24
  Bottom 0.152: v54.61,20.83 47.75,27.69 v42.42,27.69
SSD2_C  (via drill 0.35)
  Top 0.152: R12.2 U3.2 93.73,15.33 92.35,15.33 92.26,15.24 v91.44,15.24 | v39.37,22.86 41.35,22.86 U1.27
  Bottom 0.152: v91.44,15.24 91.44,16.51 36.83,16.51 36.83,22.86 v39.37,22.86
SSD2_D  (1 unrouted)
  Top 0.152: R13.2 U3.6 103.38,11.78 103.38,4.83 102.62,4.06 37.85,4.06 37.85,22.35 39.02,22.35 39.12,22.25 39.62,22.25 39.66,22.29 40.89,22.29
SSD2_LT  (via drill 0.35)  (1 unrouted)
  Top 0.152: R9.2 97.79,12.7 | U3.3 v97.79,16.51 | v43.18,29.21 43.72,28.67 U1.23
  Bottom 0.152: v43.18,29.21 57.15,29.21 57.15,17.02 67.82,17.02 v68.58,17.78 69.34,17.02 97.28,17.02 v97.79,16.51
SSD_1BL  (1 unrouted)
  Top 0.152: 77.47,12.7 R7.2 75.66,6.66 75.66,6.12 75.22,5.69 39.21,5.69 39.37,5.84 39.37,18.79 U1.32